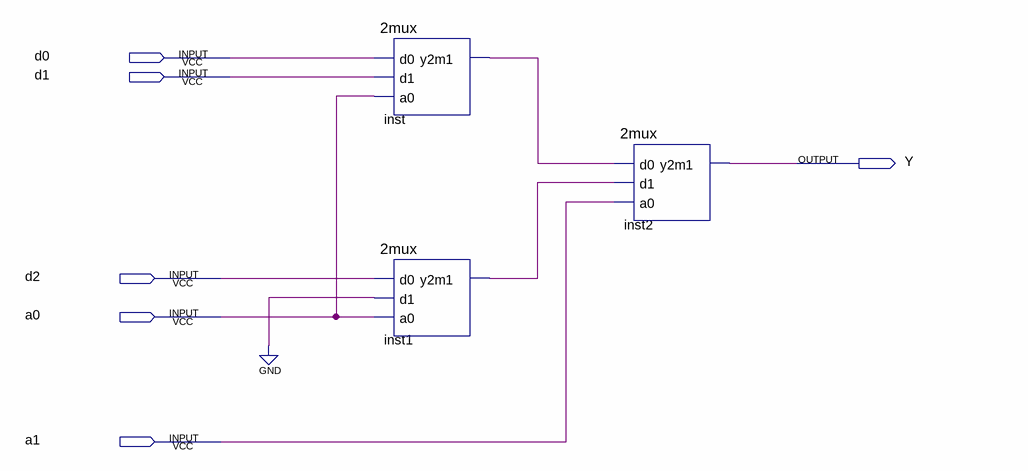
[diagram p0: schematic sheet]
// Quartus schematic block2.bdf as structural Verilog: 3 symbols, 6 pins
module block2 (
  input  d0,
  input  d1,
  input  d2,
  input  a0,
  input  a1,
  output Y
);

  wire inst1_y2m1, inst_y2m1;

  \2mux  inst (.d0(d0), .d1(d1), .a0(a0), .y2m1(inst_y2m1));
  \2mux  inst1 (.d0(d2), .d1(1'b0), .a0(a0), .y2m1(inst1_y2m1));
  \2mux  inst2 (.d0(inst_y2m1), .d1(inst1_y2m1), .a0(a1), .y2m1(Y));
endmodule
